# EAGLE design BiaBoard (EAGLE 9.6.2)

## Sheet 1 of 2
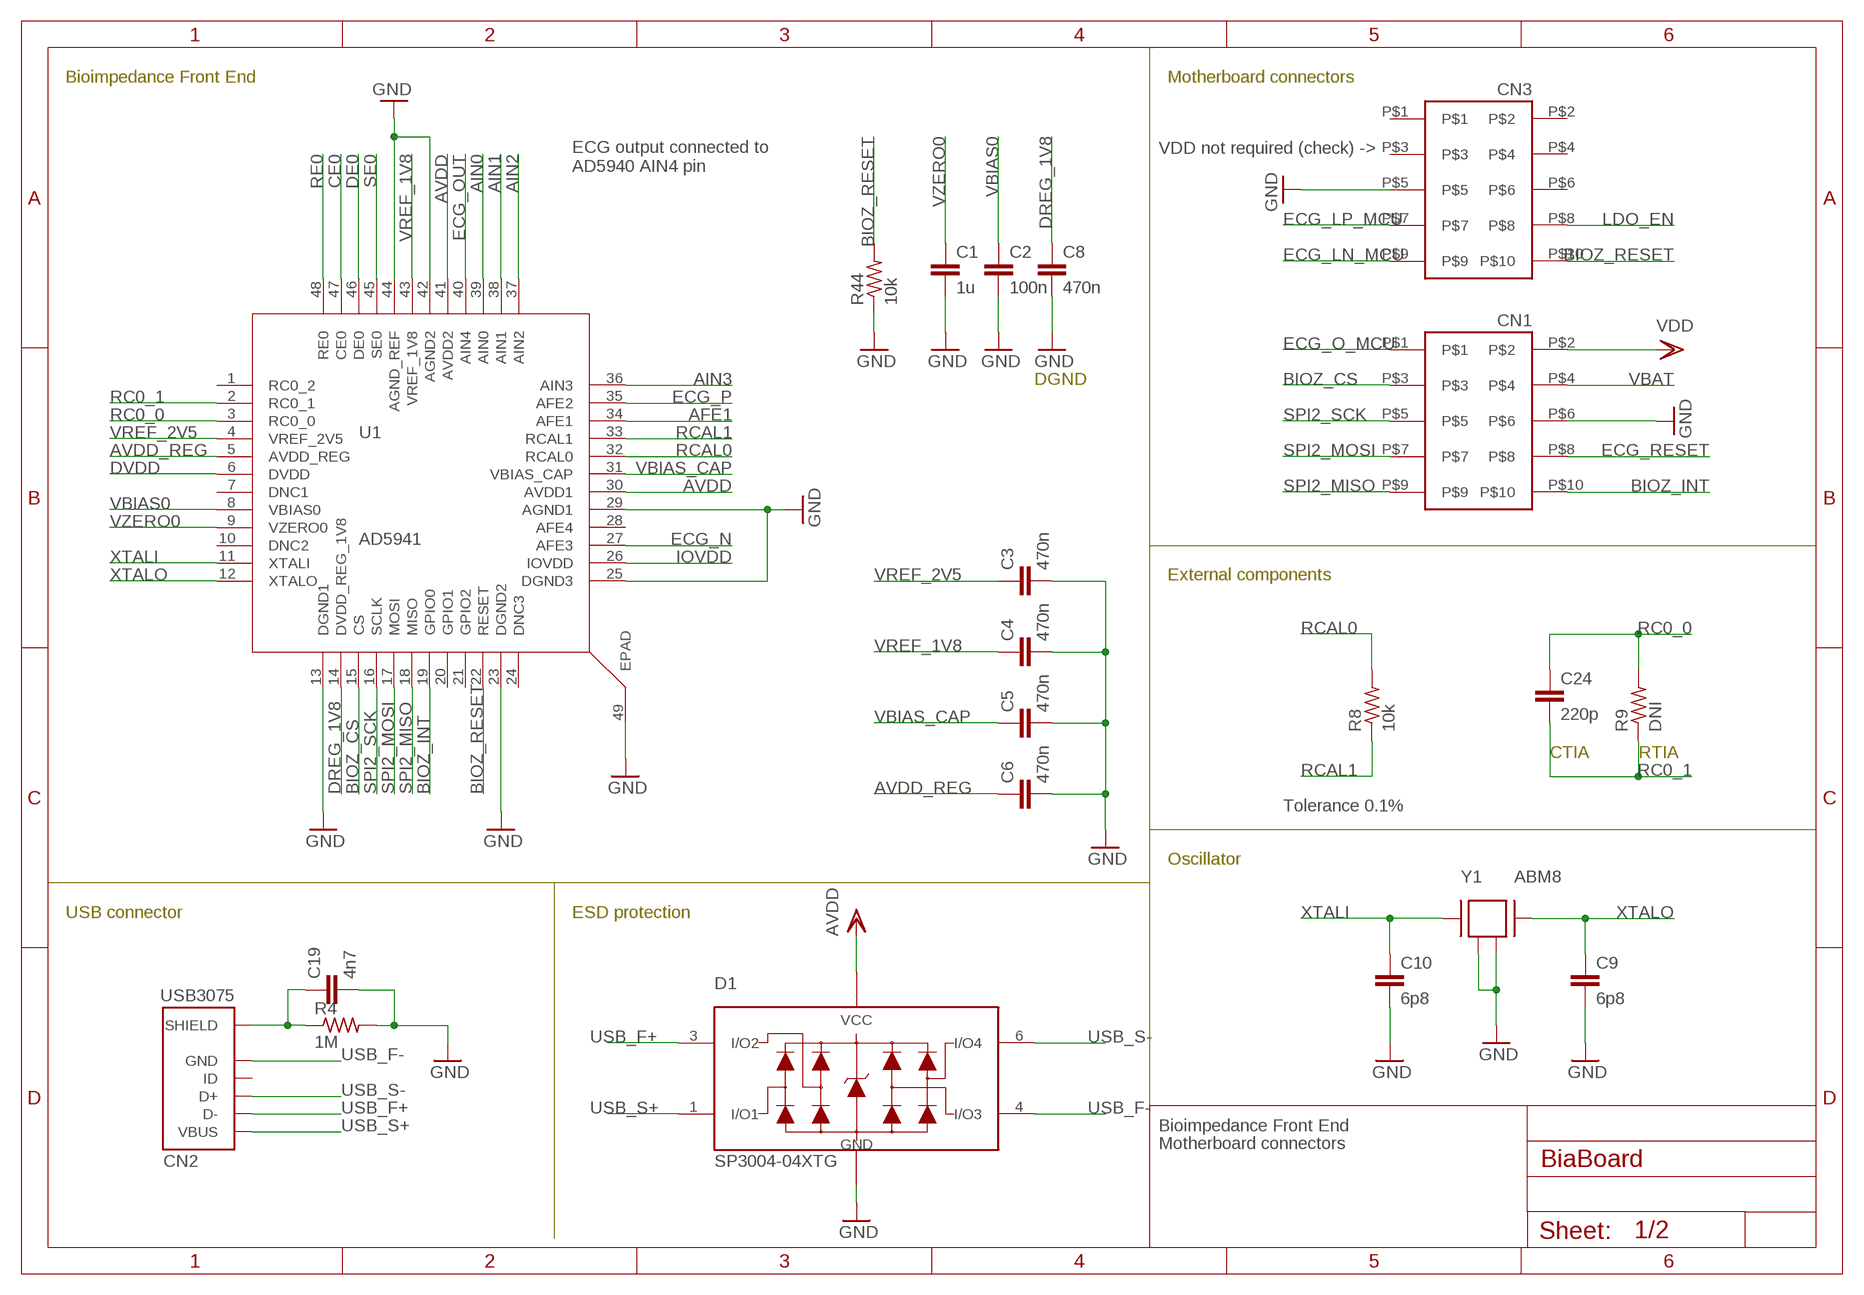
[diagram p0: schematic, sheet 1]

### Parts
C1  1u  C0402  [C0402]
C2  100n  C0402  [C0402]
C3  470n  C0402  [C0402]
C4  470n  C0402  [C0402]
C5  470n  C0402  [C0402]
C6  470n  C0402  [C0402]
C8  470n  C0402  [C0402]
C9  6p8  C0402  [C0402]
C10  6p8  C0402  [C0402]
C19  4n7  C0402  [C0402]
C24  220p  C0402  [C0402]
CN1  FTSH-105TO  [FTSH-105-D]
CN2  USB3075  [USB3075]
CN3  FTSH-105TO  [FTSH-105-D]
D1  SP3004-04XTG  [SOT50P160X60-6N]
R4  1M  R0402  [0402]
R8  10k  R0402  [0402]
R9  DNI  R0402  [0402]
R44  10k  R0402  [0402]
U1  AD5941  [QFN50P700X700X80-49T510N]
Y1  ABM8  [ABM8]

### Nets
AFE1: U1.34(AFE1) ; also sheet 2
AIN0: U1.39(AIN0) ; also sheet 2
AIN1: U1.38(AIN1) ; also sheet 2
AIN2: U1.37(AIN2) ; also sheet 2
AIN3: U1.36(AIN3) ; also sheet 2
AVDD: D1.5(VCC) U1.30(AVDD1) U1.41(AVDD2) ; also sheet 2
AVDD_REG: C6.P$1 U1.5(AVDD_REG)
BIOZ_CS: CN1.P$3 U1.15(CS)
BIOZ_INT: CN1.P$10 U1.19(GPIO0)
BIOZ_RESET: CN3.P$10 R44.P$2 U1.22(RESET)
CE0: U1.47(CE0) ; also sheet 2
DE0: U1.46(DE0) ; also sheet 2
DREG_1V8: C8.P$1 U1.14(DVDD_REG_1V8)
DVDD: U1.6(DVDD) ; also sheet 2
ECG_LN_MCU: CN3.P$9 ; also sheet 2
ECG_LP_MCU: CN3.P$7 ; also sheet 2
ECG_N: U1.27(AFE3) ; also sheet 2
ECG_O_MCU: CN1.P$1 ; also sheet 2
ECG_OUT: U1.40(AIN4) ; also sheet 2
ECG_P: U1.35(AFE2) ; also sheet 2
ECG_RESET: CN1.P$8 ; also sheet 2
GND: C1.P$2 C2.P$2 C3.P$2 C4.P$2 C5.P$2 C6.P$2 C8.P$2 C9.P$2 C10.P$2 C19.P$2 CN1.P$6 CN3.P$5 D1.2(GND) R4.P$2 R44.P$1 U1.13(DGND1) U1.23(DGND2) U1.25(DGND3) U1.29(AGND1) U1.42(AGND2) U1.44(AGND_REF) U1.49(EPAD) Y1.P$2 Y1.P$4 ; also sheet 2
IOVDD: U1.26(IOVDD) ; also sheet 2
LDO_EN: CN3.P$8 ; also sheet 2
N$2: C19.P$1 CN2.G1(SHIELD) CN2.G2(SHIELD) CN2.G3(SHIELD) CN2.G4(SHIELD) CN2.G5(SHIELD) CN2.G6(SHIELD) R4.P$1
RC0_0: C24.P$1 R9.P$2 U1.3(RC0_0)
RC0_1: C24.P$2 R9.P$1 U1.2(RC0_1)
RCAL0: R8.P$2 U1.32(RCAL0)
RCAL1: R8.P$1 U1.33(RCAL1)
RE0: U1.48(RE0) ; also sheet 2
SE0: U1.45(SE0) ; also sheet 2
SPI2_MISO: CN1.P$9 U1.18(MISO)
SPI2_MOSI: CN1.P$7 U1.17(MOSI)
SPI2_SCK: CN1.P$5 U1.16(SCLK)
USB_F+: CN2.P2(D-) D1.3(I/O2) ; also sheet 2
USB_F-: CN2.P5(GND) D1.4(I/O3) ; also sheet 2
USB_S+: CN2.P1(VBUS) D1.1(I/O1) ; also sheet 2
USB_S-: CN2.P3(D+) D1.6(I/O4) ; also sheet 2
VBAT: CN1.P$4 ; also sheet 2
VBIAS0: C2.P$1 U1.8(VBIAS0)
VBIAS_CAP: C5.P$1 U1.31(VBIAS_CAP)
VDD: CN1.P$2 ; also sheet 2
VREF_1V8: C4.P$1 U1.43(VREF_1V8)
VREF_2V5: C3.P$1 U1.4(VREF_2V5)
VZERO0: C1.P$1 U1.9(VZERO0)
XTALI: C10.P$1 U1.11(XTALI) Y1.P$1
XTALO: C9.P$1 U1.12(XTALO) Y1.P$3
Unconnected: CN2.P4(ID) CN3.P$1 CN3.P$2 CN3.P$3 CN3.P$4 CN3.P$6 U1.1(RC0_2) U1.7(DNC1) U1.10(DNC2) U1.20(GPIO1) U1.21(GPIO2) U1.24(DNC3) U1.28(AFE4)

### Notes on the sheet
- Bioimpedance Front End | Motherboard connectors
- VDD not required (check) ->
- ECG output connected to
  AD5940 AIN4 pin
- DGND
- External components
- CTIA | RTIA
- Tolerance 0.1%
- Oscillator
- USB connector | ESD protection
- Bioimpedance Front End
- Motherboard connectors

## Sheet 2 of 2
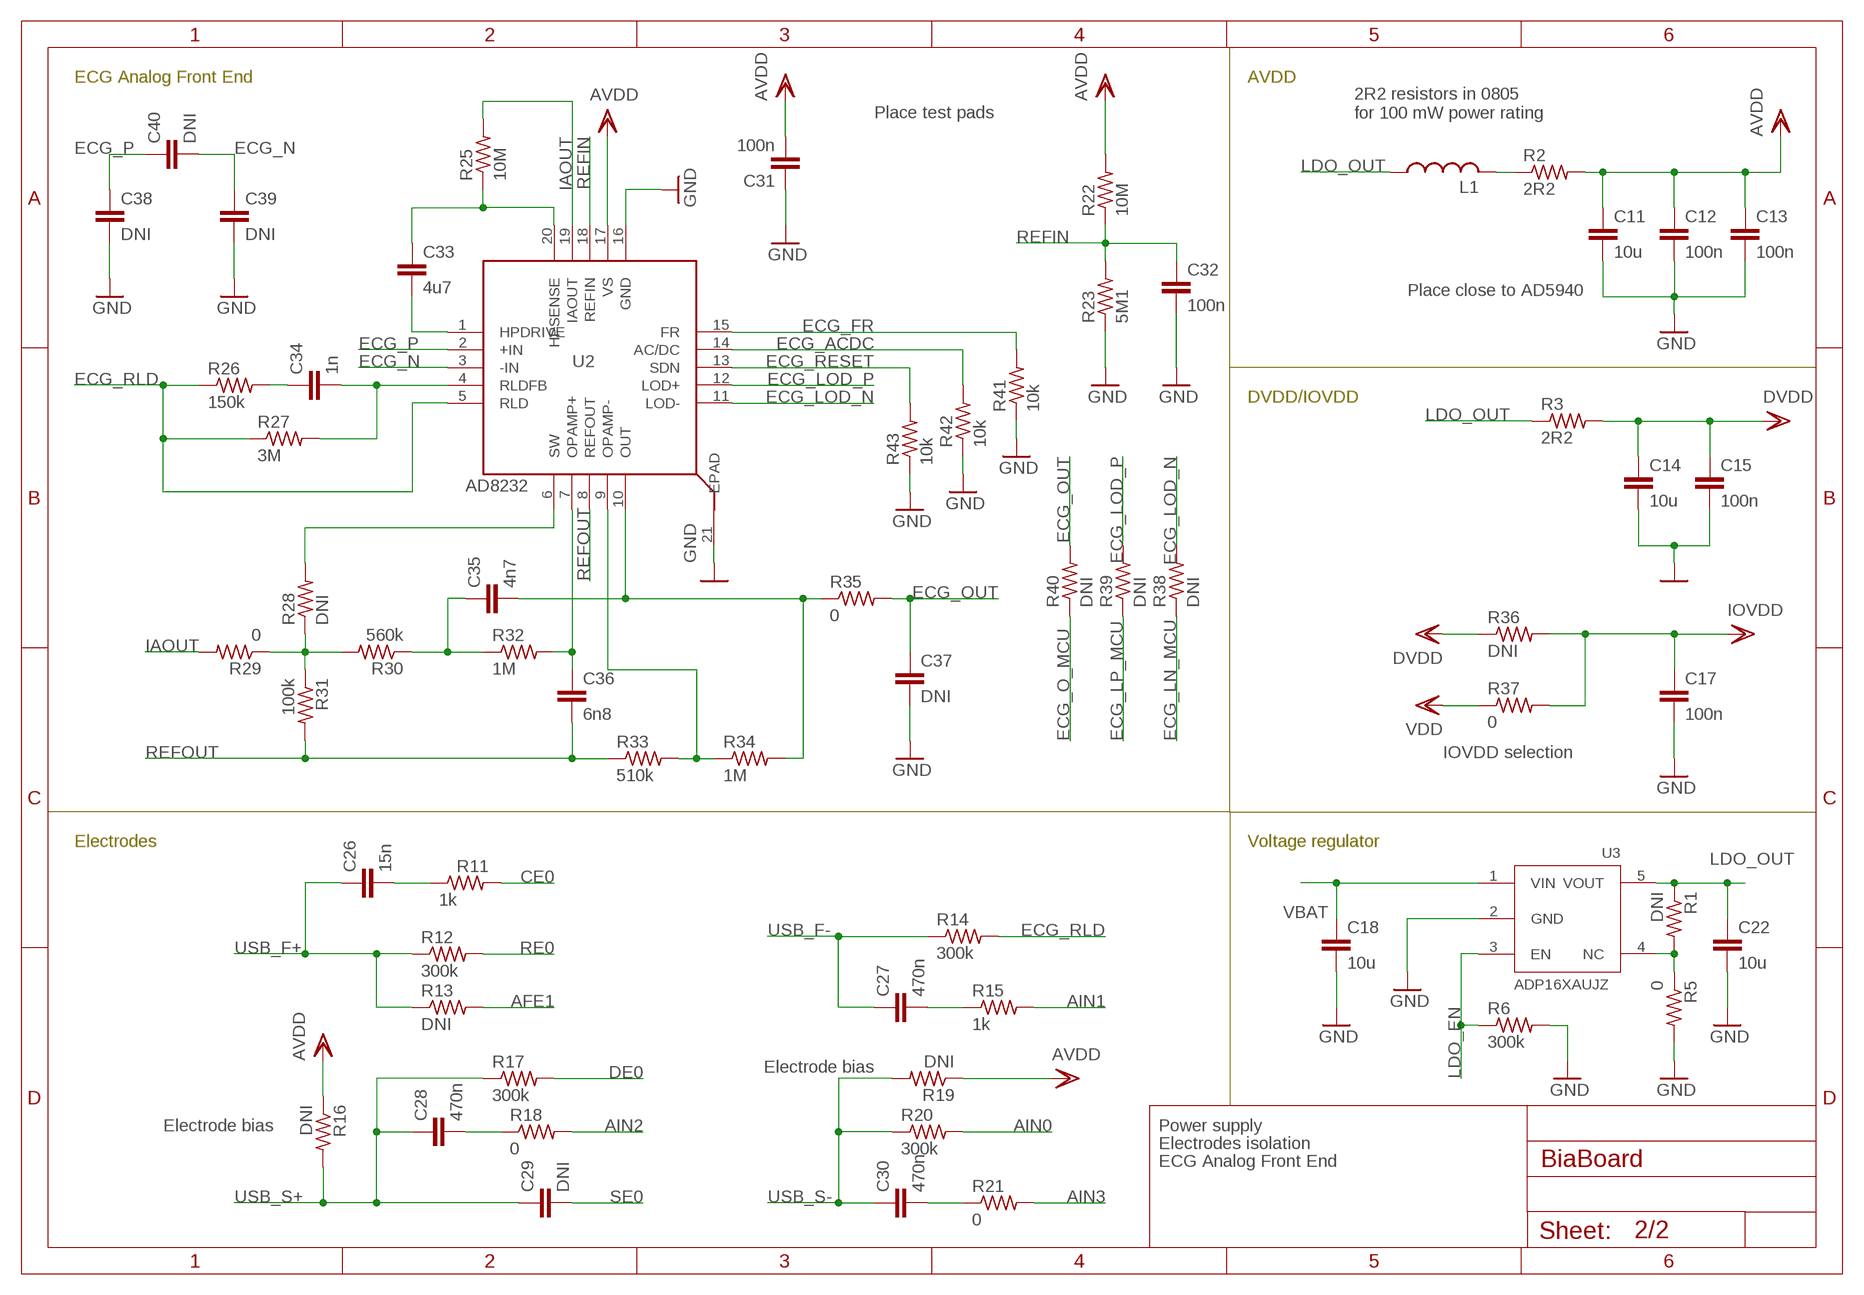
[diagram p1: schematic, sheet 2]

### Parts
C11  10u  C0603  [C0603]
C12  100n  C0402  [C0402]
C13  100n  C0402  [C0402]
C14  10u  C0603  [C0603]
C15  100n  C0402  [C0402]
C17  100n  C0402  [C0402]
C18  10u  C0603  [C0603]
C22  10u  C0603  [C0603]
C26  15n  C0402  [C0402]
C27  470n  C0402  [C0402]
C28  470n  C0402  [C0402]
C29  DNI  C0402  [C0402]
C30  470n  C0402  [C0402]
C31  100n  C0402  [C0402]
C32  100n  C0402  [C0402]
C33  4u7  C0402  [C0402]
C34  1n  C0402  [C0402]
C35  4n7  C0402  [C0402]
C36  6n8  C0402  [C0402]
C37  DNI  C0603  [C0603]
C38  DNI  C0402  [C0402]
C39  DNI  C0402  [C0402]
C40  DNI  C0402  [C0402]
L1  L0603  [0603]
R1  DNI  R0402  [0402]
R2  2R2  R0805  [0805]
R3  2R2  R0805  [0805]
R5  0  R0402  [0402]
R6  300k  R0402  [0402]
R11  1k  R0402  [0402]
R12  300k  R0402  [0402]
R13  DNI  R0402  [0402]
R14  300k  R0402  [0402]
R15  1k  R0402  [0402]
R16  DNI  R0402  [0402]
R17  300k  R0402  [0402]
R18  0  R0402  [0402]
R19  DNI  R0402  [0402]
R20  300k  R0402  [0402]
R21  0  R0402  [0402]
R22  10M  R0402  [0402]
R23  5M1  R0402  [0402]
R25  10M  R0402  [0402]
R26  150k  R0402  [0402]
R27  3M  R0402  [0402]
R28  DNI  R0402  [0402]
R29  0  R0402  [0402]
R30  560k  R0402  [0402]
R31  100k  R0603  [0603]
R32  1M  R0402  [0402]
R33  510k  R0402  [0402]
R34  1M  R0402  [0402]
R35  0  R0402  [0402]
R36  DNI  R0402  [0402]
R37  0  R0402  [0402]
R38  DNI  R0402  [0402]
R39  DNI  R0402  [0402]
R40  DNI  R0402  [0402]
R41  10k  R0402  [0402]
R42  10k  R0402  [0402]
R43  10k  R0402  [0402]
U2  AD8232  [QFN50P400X400X75-21T260N]
U3  ADP16XAUJZ  [TSOT23-5L]

### Nets
AFE1: R13.P$2 ; also sheet 1
AIN0: R20.P$2 ; also sheet 1
AIN1: R15.P$2 ; also sheet 1
AIN2: R18.P$2 ; also sheet 1
AIN3: R21.P$2 ; also sheet 1
AVDD: C11.P$1 C12.P$1 C13.P$1 C31.P$2 R2.P$2 R16.P$1 R19.P$1 R22.P$2 U2.17(VS) ; also sheet 1
CE0: R11.P$2 ; also sheet 1
DE0: R17.P$2 ; also sheet 1
DVDD: C14.P$1 C15.P$1 R3.P$2 R36.P$1 ; also sheet 1
ECG_ACDC: R42.P$2 U2.14(AC/DC)
ECG_FR: R41.P$2 U2.15(FR)
ECG_LN_MCU: R38.P$1 ; also sheet 1
ECG_LOD_N: R38.P$2 U2.11(LOD-)
ECG_LOD_P: R39.P$2 U2.12(LOD+)
ECG_LP_MCU: R39.P$1 ; also sheet 1
ECG_N: C39.P$1 C40.P$2 U2.3(-IN) ; also sheet 1
ECG_O_MCU: R40.P$1 ; also sheet 1
ECG_OUT: C37.P$1 R35.P$2 R40.P$2 ; also sheet 1
ECG_P: C38.P$1 C40.P$1 U2.2(+IN) ; also sheet 1
ECG_RESET: R43.P$2 U2.13(SDN) ; also sheet 1
ECG_RLD: R14.P$2 R26.P$1 R27.P$1 U2.5(RLD)
GND: C11.P$2 C12.P$2 C13.P$2 C14.P$2 C15.P$2 C17.P$2 C18.P$2 C22.P$2 C31.P$1 C32.P$2 C37.P$2 C38.P$2 C39.P$2 R5.P$2 R6.P$2 R23.P$1 R41.P$1 R42.P$1 R43.P$1 U2.16(GND) U2.21(EPAD) U3.2(GND) ; also sheet 1
IAOUT: R25.P$2 R29.P$2 U2.19(IAOUT)
IOVDD: C17.P$1 R36.P$2 R37.P$2 ; also sheet 1
LDO_EN: R6.P$1 U3.3(EN) ; also sheet 1
LDO_OUT: C22.P$1 L1.P$1 R1.P$1 R3.P$1 U3.5(VOUT)
N$1: L1.P$2 R2.P$1
N$3: C26.P$2 R11.P$1
N$4: R1.P$2 R5.P$1 U3.4(NC)
N$7: C27.P$2 R15.P$1
N$8: C30.P$2 R21.P$1
N$9: C28.P$2 R18.P$1
N$14: C33.P$1 R25.P$1 U2.20(HPSENSE)
N$15: C34.P$2 R27.P$2 U2.4(RLDFB)
N$16: C33.P$2 U2.1(HPDRIVE)
N$17: R28.P$1 R29.P$1 R30.P$2 R31.P$1
N$18: C34.P$1 R26.P$2
N$20: R28.P$2 U2.6(SW)
N$21: C35.P$1 R30.P$1 R32.P$1
N$23: C35.P$2 R34.P$2 R35.P$1 U2.10(OUT)
N$24: C36.P$1 R32.P$2 U2.7(OPAMP+)
N$27: R33.P$2 R34.P$1 U2.9(OPAMP-)
RE0: R12.P$2 ; also sheet 1
REFIN: C32.P$1 R22.P$1 R23.P$2 U2.18(REFIN)
REFOUT: C36.P$2 R31.P$2 R33.P$1 U2.8(REFOUT)
SE0: C29.P$2 ; also sheet 1
USB_F+: C26.P$1 R12.P$1 R13.P$1 ; also sheet 1
USB_F-: C27.P$1 R14.P$1 ; also sheet 1
USB_S+: C28.P$1 C29.P$1 R16.P$2 R17.P$1 ; also sheet 1
USB_S-: C30.P$1 R19.P$2 R20.P$1 ; also sheet 1
VBAT: C18.P$1 U3.1(VIN) ; also sheet 1
VDD: R37.P$1 ; also sheet 1

### Notes on the sheet
- ECG Analog Front End | AVDD
- Place test pads
- 2R2 resistors in 0805
  for 100 mW power rating
- Place close to AD5940
- DVDD/IOVDD
- IOVDD selection
- Electrodes | Voltage regulator
- Electrode bias
- Electrode bias | Power supply
- Electrodes isolation
- ECG Analog Front End

## Library data of the parts
C1-C6 C8-C15 C17-C19 C22 C24 C26-C40 = Andrea_passives:C
CN1 CN3 = Andrea_Conn:FTSH-105
CN2 = Andrea_Conn:USB3075: USB3075 Micro USB 2.0 Connector
D1 = Andrea_diodes:SP3004-04XTG: TVS Diode Array Low Capacitance ESD Protection
L1 = Andrea_passives:L; PN: BLM41A800SPB-1806; TOTAL_SURFACE: 36
R1-R6 R9 R11-R23 R25-R44 = Andrea_passives:R
R8 = Andrea_passives:R; TOLERANCE: 0.1%
U1 = Andrea_AD:AD5941: AD5941 High Precision, Impedance, and Electrochemical Front End; PN: AD5941BCPZ; TOTAL_SURFACE: 70
U2 = Andrea_AD:AD8232: AD8232 Single-Lead, Heart Rate Monitor Front End
U3 = Andrea_AD:ADP16X: 5-Lead Thin Small Outline Transistor Package [TSOT] (UJ-5)
Y1 = Andrea_crystals:ABM8: ABM8 Ceramic SMD crystal; PN: ABM8-16.000MHZ-7-1-U-T

## Board
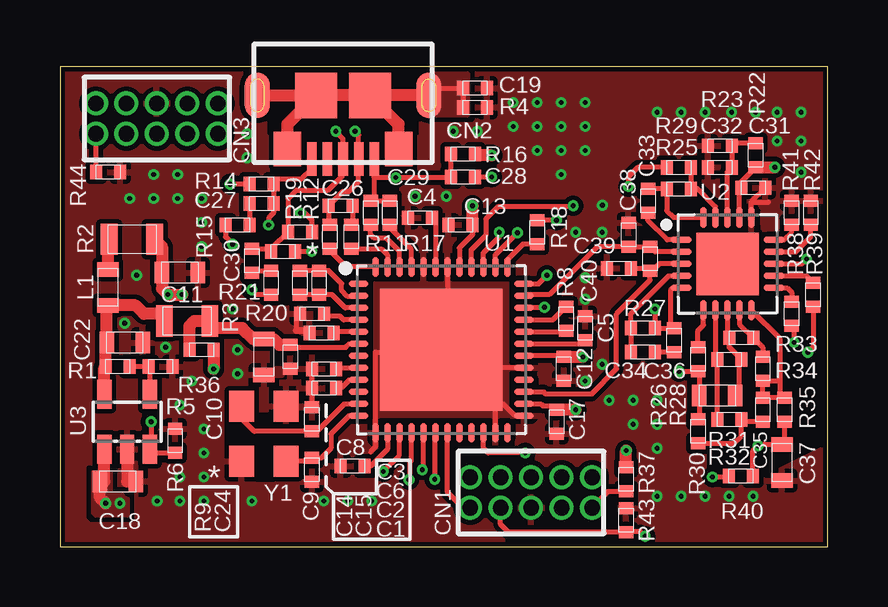
[diagram p2: board, top side]
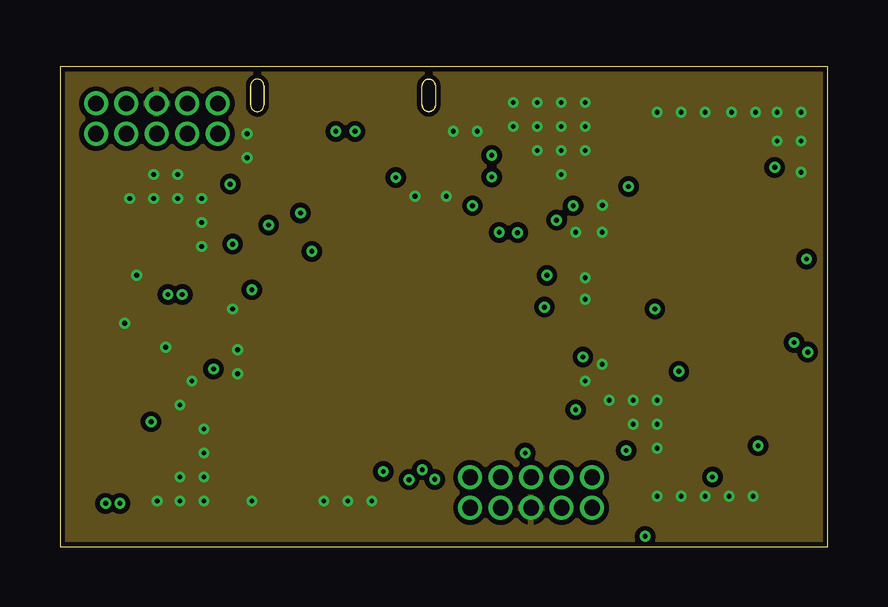
[diagram p3: board, inner layer Route2]
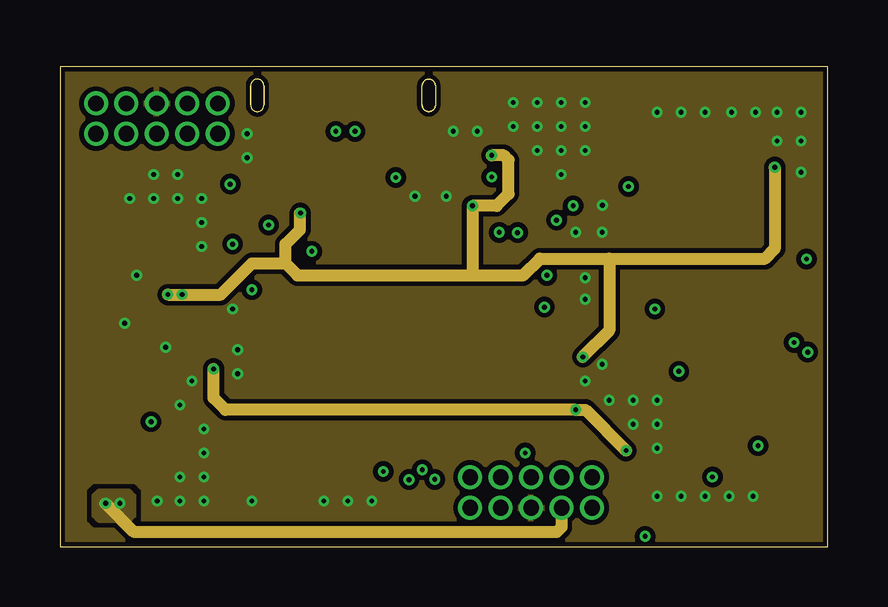
[diagram p4: board, inner layer Route3]
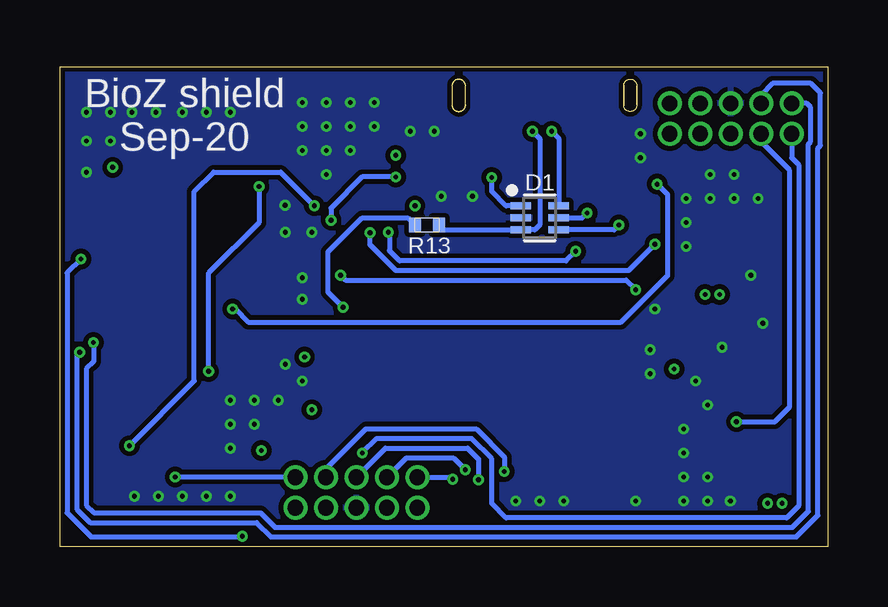
[diagram p5: board, bottom side, seen from below]

Size 32 x 20 mm. Coordinates in mm from the lower left corner, seen from the top.
Outline: 15.1,18.4 15.1,19.2 arc-175 15.65,19.22 15.65,19.2 15.65,18.4 15.65,18.38 arc-175 15.1,18.4
Outline: 7.95,18.4 arc175 8.5,18.38 8.5,18.4 8.5,19.2 8.5,19.22 arc175 7.95,19.2 7.95,18.4
Outline: 0,20 0,0 32,0 32,20 0,20
Copper layers (1+2*3+16): Top 0.018mm / dielectric 0.36mm / Route2 0.035mm / dielectric 0.71mm / Route3 0.035mm / dielectric 0.36mm / Bottom 0.018mm
Design rules "eC_4Layer_PClass6_BaseCopperO18-I35_eCDefault *": minimum track width 0.2mm, minimum drill 0.2mm, track to track 0.2mm, track to pad 0.2mm, pad to pad 0.2mm, via to via 0.2mm, smd to smd 0.2mm, copper to edge 0.2mm, drill to drill 0.2mm, minimum pad ring 0.175mm, minimum via ring 0.125mm, stop-mask expansion 0mil, vias tented up to drill 0.45mm, thermal gap 0.2mm
tRestrict: 31 lines

### Footprints (pad centres in the part's own frame; a part is rotated, then mirrored left to right if it is on the bottom)
C0402 = smd 0.5 x 0.6: P$1 -0.5,0; P$2 0.5,0
C0603 = smd 0.6 x 0.9: P$1 -0.75,0; P$2 0.75,0
FTSH-105-D = drill 0.65 pad 1: P$1 0.5,1.07; P$2 0.5,2.34; P$3 1.77,1.07; P$4 1.77,2.34; P$5 3.04,1.07; P$6 3.04,2.34; P$7 4.31,1.07; P$8 4.31,2.34; P$9 5.58,1.07; P$10 5.58,2.34
USB3075 = smd 1.15 x 1.45: G1 -2.32,2.23; G6 2.32,2.23 | smd 1.05 x 1.9: G2 -3.575,0; G5 3.575,0 | smd 1.75 x 1.9: G3 -1.125,0; G4 1.125,0 | smd 0.4 x 1.4: P1 -1.3,2.65; P2 -0.65,2.65; P3 0,2.65; P4 0.65,2.65; P5 1.3,2.65
SOT50P160X60-6N = smd 0.86 x 0.28: 1 -0.785,0.5; 2 -0.785,0; 3 -0.785,-0.5; 4 0.785,-0.5; 5 0.785,0; 6 0.785,0.5
0603 = smd 0.6 x 0.9: P$1 -0.75,0; P$2 0.75,0
0402 = smd 0.5 x 0.6: P$1 -0.5,0; P$2 0.5,0
0805 = smd 0.7 x 1.3: P$1 -0.95,0; P$2 0.95,0
QFN50P700X700X80-49T510N = smd 0.811 x 0.264: 1 -3.451,2.75; 2 -3.451,2.25; 3 -3.451,1.75; 4 -3.451,1.25; 5 -3.451,0.75; 6 -3.451,0.25; 7 -3.451,-0.25; 8 -3.451,-0.75; 9 -3.451,-1.25; 10 -3.451,-1.75; 11 -3.451,-2.25; 12 -3.451,-2.75; 25 3.451,-2.75; 26 3.451,-2.25; 27 3.451,-1.75; 28 3.451,-1.25; 29 3.451,-0.75; 30 3.451,-0.25; 31 3.451,0.25; 32 3.451,0.75; 33 3.451,1.25; 34 3.451,1.75; 35 3.451,2.25; 36 3.451,2.75 | smd 0.264 x 0.811: 13 -2.75,-3.451; 14 -2.25,-3.451; 15 -1.75,-3.451; 16 -1.25,-3.451; 17 -0.75,-3.451; 18 -0.25,-3.451; 19 0.25,-3.451; 20 0.75,-3.451; 21 1.25,-3.451; 22 1.75,-3.451; 23 2.25,-3.451; 24 2.75,-3.451; 37 2.75,3.451; 38 2.25,3.451; 39 1.75,3.451; 40 1.25,3.451; 41 0.75,3.451; 42 0.25,3.451; 43 -0.25,3.451; 44 -0.75,3.451; 45 -1.25,3.451; 46 -1.75,3.451; 47 -2.25,3.451; 48 -2.75,3.451 | smd 5.1 x 5.1: 49 0,0
QFN50P400X400X75-21T260N = smd 0.86 x 0.264: 1 -1.935,1; 2 -1.935,0.5; 3 -1.935,0; 4 -1.935,-0.5; 5 -1.935,-1; 11 1.935,-1; 12 1.935,-0.5; 13 1.935,0; 14 1.935,0.5; 15 1.935,1 | smd 0.264 x 0.86: 6 -1,-1.935; 7 -0.5,-1.935; 8 0,-1.935; 9 0.5,-1.935; 10 1,-1.935; 16 1,1.935; 17 0.5,1.935; 18 0,1.935; 19 -0.5,1.935; 20 -1,1.935 | smd 2.6 x 2.6: 21 0,0
TSOT23-5L = smd 0.6 x 1.2: 1 -0.95,-1.15; 2 0,-1.15; 3 0.95,-1.15; 4 0.95,1.15; 5 -0.95,1.15
ABM8 = smd 1.3 x 1.05: P$1 -1.15,-0.925; P$2 1.15,-0.925; P$3 1.15,0.925; P$4 -1.15,0.925

### Placement (x,y rotation side)
C1  11,6.6 180 top
C2  11,7.4 180 top
C3  10.5,9.7 180 top
C4  15,13.7 180 top
C5  21.9,9.1 90 top
C6  10.9,8.9 180 top
C8  12.2,3.35 180 top
C9  10.5,3.2 270 top
C10  10.5,5.3 90 top
C11  5,11.42 0 top
C12  21,7.4 270 top
C13  16.7,13.4 180 top
C14  8.5,7.9 270 top
C15  9.6,7.9 270 top
C17  20.7,5.2 270 top
C18  2.41,2.72 0 top
C19  17.3,19.1 0 top
C22  2.7,8.5 0 top
C24  10.8,11 90 top
C26  11.7,14.2 0 top
C27  8.4,14.3 180 top
C28  16.8,15.4 0 top
C29  13.75,13.9 270 top
C30  8,11.9 270 top
C31  28.9,14.95 180 top
C32  27.5,15.8 180 top
C33  24.52,14.41 270 top
C34  24.3,8.1 180 top
C35  29.3,5.7 90 top
C36  27.9,7.8 0 top
C37  30.1,3.5 270 top
C38  23.7,13 90 top
C39  23.3,11.59 180 top
C40  24.6,12 270 top
CN1  22.68,3.96 180 top
CN2  11.8,18.8 180 top
CN3  7.08,19.54 180 top
D1  12,13.7 0 bottom
L1  2,10.8 90 top
R1  2.4,7.5 0 top
R2  3,12.8 0 top
R3  5.3,9.4 0 top
R4  17.3,18.3 0 top
R5  4.2,7.5 0 top
R6  4.8,4.4 90 top
R8  21.1,9.5 270 top
R9  10,11 270 top
R11  12.15,12.9 270 top
R12  11.25,12.9 270 top
R13  16.7,13.4 180 bottom
R14  8.4,15.1 180 top
R15  7.4,13.4 180 top
R16  16.8,16.35 180 top
R17  12.95,13.9 270 top
R18  19.9,13.1 270 top
R19  10,13.1 180 top
R20  9.3,12.3 0 top
R21  8.8,11 270 top
R22  29,16.3 270 top
R23  27.5,16.7 0 top
R25  25.8,14.9 0 top
R26  25.6,8.6 270 top
R27  24.3,9.1 180 top
R28  26.6,7.8 90 top
R29  25.8,15.8 0 top
R30  26.6,4.8 90 top
R31  27.4,6.3 0 top
R32  27.9,5.3 180 top
R33  28.4,8.7 0 top
R34  29.3,7.4 270 top
R35  30.2,5.7 270 top
R36  5.9,8.2 0 top
R37  23.6,2.8 90 top
R38  30.5,9.7 90 top
R39  31.4,10.5 90 top
R40  28.39,2.94 0 top
R41  30.5,13.9 270 top
R42  31.3,13.9 270 top
R43  23.6,1.1 270 top
R44  2,15.6 180 top
U1  15.9,8.2 0 top
U2  27.83,11.78 0 top
U3  2.8,5.2 0 top
Y1  8.5,4.7 270 top

### Tracks (layer width: path | path; a pad name or v marks a point on that pad's centre or on a via)
AFE1  (via drill 0.2)
  Top 0.2: U1.34 19.38,9.97 v20.2,9.97
  Bottom 0.2: R13.P$2 17.5,13.7 19.4,13.7 20.82,12.28 20.82,10.6 v20.2,9.97
AIN0  (via drill 0.2)
  Top 0.2: U1.39 17.65,12.23 18.31,12.89 v18.31,13.09 | R20.P$2 v10.5,12.3
  Bottom 0.2: v10.5,12.3 10.9,11.9 17.83,11.9 18.27,12.33 18.27,13.05 v18.31,13.09
AIN1  (via drill 0.2)
  Top 0.2: U1.38 18.15,12.15 v19.08,13.08 | R15.P$2 6.9,12.9 v7.2,12.6
  Bottom 0.2: v7.2,12.6 8.3,11.5 18,11.5 19.08,12.58 v19.08,13.08
AIN2
  Top 0.2: 18.65,11.68 U1.37 18.65,11.95 19.3,12.6 R18.P$2
AIN3  (via drill 0.2)
  Top 0.2: v20.3,11.3 19.95,10.95 U1.36 | R21.P$2 8.2,10.5 v8,10.7
  Bottom 0.2: v20.3,11.3 20.1,11.1 8.4,11.1 v8,10.7
AVDD  (via drill 0.2)
  Top 0.2: C12.P$1 20.95,7.95 U1.30 | U2.17 28.33,14.88 C31.P$2 28.4,15.2 R22.P$2 | 17.35,16.3 R16.P$1 | R19.P$1 10.5,13.6 10.2,13.9 v10.03,13.9 | 17.2,13.2 C13.P$1 17.2,13 16.65,12.45 U1.41
  Top 0.5: R22.P$2 v29.8,15.8 | C12.P$1 v21.8,7.9 | v18,16.3 17.35,16.3 | C13.P$1 v17.2,14.2 | v5.1,10.5 v4.5,10.5 4.25,10.75 C11.P$1 4.25,12.5 R2.P$2
  Route3 0.2: 10,13.88 v10.03,13.9
  Route3 0.5: 9.4,11.8 9.9,11.3 17.2,11.3 | 17.2,11.3 19.3,11.3 20,12 22.9,12 | 22.9,12 29.4,12 29.8,12.4 v29.8,15.8 | 9.4,11.8 9.4,12.6 10,13.2 10,13.88 | 22.9,12 22.9,9 v21.8,7.9 | 17.2,11.3 v17.2,14.2 18.2,14.2 18.7,14.7 18.7,16.1 18.5,16.3 v18,16.3 | v4.5,10.5 6.7,10.5 8,11.8 9.4,11.8
  Bottom 0.2: D1.5 10.22,13.7 v10.03,13.9
AVDD_REG
  Top 0.2: U1.5 11.45,8.95 C6.P$1
BIOZ_CS  (via drill 0.2)
  Top 0.2: v13.47,3.13 14.15,3.81 U1.15
  Bottom 0.2: CN1.P$3 20.91,3.24 19.25,4.9 14.64,4.9 13.47,3.73 v13.47,3.13
BIOZ_INT
  Top 0.2: CN1.P$10 16.8,1.62 16.15,2.27 U1.19
BIOZ_RESET  (via drill 0.2)
  Top 0.2: v19.4,3.9 17.85,3.9 17.65,4.1 U1.22 | R44.P$2 CN3.P$10
  Bottom 0.2: CN3.P$10 1.5,16.2 1.2,15.9 1.2,1.7 1.7,1.2 13.4,1.2 14,1.8 14,3.66 14.84,4.5 18.8,4.5 v19.4,3.9
CE0
  Top 0.2: R11.P$2 13.4,12.4 13.65,12.15 U1.47
DE0
  Top 0.2: U1.46 14.15,12.32 13.62,12.85 13.1,12.85 12.95,13 R17.P$2
DREG_1V8
  Top 0.2: C8.P$1 12.95,3.35 13.65,4.05 U1.14
DVDD
  Top 0.2: C15.P$1 9.7,8.3 11.91,8.3 12.05,8.43 12.43,8.43 U1.6 | R3.P$2 6.55,9.1
  Top 0.5: R36.P$1 5.4,9.2 5.6,9.4 R3.P$2 | 6.55,9.1 7.6,9.1 8.05,8.65 C14.P$1 8.9,8.65 9.15,8.4 C15.P$1
ECG_ACDC
  Top 0.2: 29.79,12.3 U2.14 30.68,12.28 31.3,12.9 R42.P$2
ECG_FR
  Top 0.2: 29.79,12.8 U2.15 30.18,12.78 30.5,13.1 R41.P$2
ECG_LN_MCU  (via drill 0.2)
  Top 0.2: R38.P$1 30.6,9.1 v30.6,8.5
  Bottom 0.2: v30.6,8.5 30.6,7.7 30.9,7.4 30.9,1.73 30.57,1.4 23.63,1.4 23.03,0.8 1.47,0.8 0.8,1.47 0.8,16.77 0.7,16.87 0.7,18.3 0.87,18.47 CN3.P$9
ECG_LOD_N
  Top 0.2: U2.11 30.32,10.78 30.5,10.6 R38.P$2
ECG_LOD_P
  Top 0.2: U2.12 31.12,11.28 R39.P$2
ECG_LP_MCU  (via drill 0.2)
  Top 0.2: R39.P$1 31.4,8.32 v31.18,8.1
  Bottom 0.2: v31.18,8.1 31.3,7.97 31.3,1.57 30.73,1 23.8,1 23.2,0.4 1.3,0.4 0.4,1.3 0.4,16.6 0.3,16.7 0.3,18.9 0.7,19.3 2.3,19.3 2.77,18.83 CN3.P$7
ECG_N
  Top 0.2: U2.3 24.98,11.78 24.7,11.5 C40.P$2 | U1.27 20.15,6.45 20.25,6.35 22.15,6.35 23.2,7.4 23.2,9.7 24.6,11.1 C40.P$2 | C39.P$1 24.51,11.59 C40.P$2
ECG_O_MCU  (via drill 0.2)
  Top 0.2: R40.P$1 27.85,2.9 v27.2,2.9
  Bottom 0.2: v27.2,2.9 CN1.P$1
ECG_OUT  (via drill 0.2)
  Top 0.2: R35.P$2 30.2,4.35 C37.P$1 | C37.P$1 30.06,4.29 | U1.40 17.15,12.38 17.75,12.98 17.75,13.65 18.25,14.15 21.4,14.15 v21.4,14.2 | C37.P$1 29.15,4.25 v29.1,4.2 28.89,3.99 R40.P$2
  Bottom 0.2: v29.1,4.2 26.4,6.9 26.4,14.8 25.6,15.6 22.8,15.6 v21.4,14.2
ECG_P
  Top 0.2: 25.86,12.3 25.86,12.31 U2.2 24.82,12.28 C40.P$1 C38.P$1 22.4,12.5 20.4,10.5 19.4,10.5 U1.35
ECG_RESET  (via drill 0.2)
  Top 0.2: U2.13 30.92,11.78 v31.12,11.98 | CN1.P$8 18.37,0.93 18.7,0.6 R43.P$2 23.62,0.62 24.2,0.62 v24.4,0.42
  Bottom 0.2: v24.4,0.42 24.43,0.4 30.7,0.4 31.7,1.4 31.7,11.4 v31.12,11.98
ECG_RLD  (via drill 0.2)
  Top 0.2: U2.5 25.55,10.78 25.45,10.69 25.45,9.25 R26.P$1 R27.P$1 v24.8,9.9 | R14.P$2 v7.1,15.1
  Bottom 0.2: v24.8,9.9 24.7,9.9 24.15,9.35 8.61,9.35 6.67,11.28 6.67,14.68 v7.1,15.1
GND  (via drill 0.2)
  Top 0.2: U2.21 28.08,11.78 28.83,12.53 | C10.P$2 C1.P$2 C2.P$2 | U1.29 16.65,7.45 | 16.65,7.45 16,8.1 | 16,8.1 U1.49 | U1.42 16.15,8.25 16,8.1 | U1.23 18.15,5.95 | 18.15,5.95 16.65,7.45 | U1.25 19.33,5.47 18.95,5.47 18.47,5.95 18.15,5.95 | 16,8.1 13.15,8.1 13.15,5.02 U1.13 13.15,4.15 12.95,3.95 | C6.P$2 10.3,9 10.2,9 | C3.P$2 9.85,9.55 9.85,9 | C31.P$1 28.83,14.38 U2.16 28.83,14.35 29.55,14.35
  Top 0.3: 10.2,9 9.85,9
  Top 0.5: U3.2 2.8,2.72 C18.P$2
  other vias: 13,1.9 12,1.9 11,1.9 8,1.9 6,1.9 5,1.9 6,2.9 6,3.9 6,4.9 5,5.9 7.4,7.2 7.4,8.2 7.2,9.9 5.9,12.5 5.9,13.5 5.9,14.5 4.9,15.5 3.9,15.5 7.8,16.2 18.9,17.5 18.9,18.5 19.9,18.5 19.9,17.5 19.9,16.5 20.9,16.5 20.9,17.5 20.9,18.5 20.9,15.5 21.9,16.5 21.9,17.5 21.9,18.5 25.9,18.1 26.9,18.1 28,18.1 29,18.1 24.9,18.1 29.9,18.1 30.9,15.6 30.9,18.1 30.9,16.9 29.9,16.9 21.9,10.3 21.9,6.9 22.6,7.6 21.9,11.2 21.5,13.1 22.6,13.1 22.62,14.22 14.8,14.6 16.1,14.6 17.4,17.3 16.4,17.3 7.8,17.2 24.9,2.1 25.9,2.1 26.9,2.1 27.9,2.1 28.9,2.1 24.9,4.1 24.9,5.1 24.9,6.1 23.9,6.1 22.9,6.1 23.9,5.1 5.5,6.9 5,2.9 4.05,1.9 2.7,9.3 3.2,11.3 3.9,14.5 4.9,14.5 2.9,14.5 4.4,8.3
  pour Route2 (rank 4): 0,0 0,20 32,20 32,0
  pour Top (rank 4): 0,0 32,0 32,20 0,20
  pour Route3 (rank 4): 0,0 32,0 32,20 0,20
  pour Bottom: 0,0 32,0 32,20 0,20
IAOUT
  Top 0.2: U2.19 27.33,14.17 26.6,14.9 R25.P$2 R29.P$2
IOVDD  (via drill 0.2)
  Top 0.2: U1.26 20.05,5.95 20.15,5.85 20.55,5.85 C17.P$1
  Top 0.5: R37.P$2 v23.6,4 | v21.5,5.7 C17.P$1 | R36.P$2 v6.4,7.4
  Route3 0.5: v6.4,7.4 6.4,6.2 6.9,5.7 v21.5,5.7 21.9,5.7 v23.6,4
LDO_EN  (via drill 0.2)
  Top 0.2: v3.8,5.2 3.8,4.1 U3.3 3.9,3.9 R6.P$1
  Bottom 0.2: CN3.P$8 2.77,16.87 1.6,15.7 1.6,5.8 2.2,5.2 v3.8,5.2
LDO_OUT
  Top 0.2: R1.P$1 1.95,7.55 | C22.P$1 1.95,8.6
  Top 0.5: U3.5 1.85,7.45 R1.P$1 1.9,8.55 1.95,8.6 | L1.P$1 2,10 | R3.P$1 4.35,9.7 3.5,9.7 3.15,10.05 L1.P$1 | C22.P$1 1.95,10 L1.P$1
N$1
  Top 0.5: L1.P$2 2,12.75 R2.P$1
N$2
  Top 0.2: R4.P$1 C19.P$1 15.68,19.1 CN2.G2
  Top 0.5: CN2.G1 14.12,17.61 CN2.G3 | CN2.G6 9.48,17.61 CN2.G4 | CN2.G2 CN2.G3 | CN2.G3 CN2.G4 | CN2.G5 CN2.G4
  pour Top (no thermals): 15.2,18 17,18 17,19.7 15.2,19.7
N$3
  Top 0.2: C26.P$2 12.2,13.45 R11.P$1
N$4
  Top 0.2: U3.4 3.75,7.45 R5.P$1 R1.P$2
N$7
  Top 0.2: C27.P$2 R15.P$1
N$8
  Top 0.2: C30.P$2 8.1,11.5 R21.P$1
N$9  (via drill 0.2)
  Top 0.2: C28.P$2 v18,15.4 | v20.7,13.6 R18.P$1
  Bottom 0.2: v18,15.4 19.4,15.4 20.7,14.1 v20.7,13.6
N$14
  Top 0.2: 26.83,13.97 U2.20 25.59,13.71 25.3,14 R25.P$1 C33.P$1
N$15
  Top 0.2: C34.P$2 R27.P$2 23.8,9.7 25.38,11.28 U2.4
N$16
  Top 0.2: U2.1 25.32,12.78 24.52,13.58 C33.P$2
N$17  (via drill 0.2)
  Top 0.2: R30.P$2 26.65,5.35 R31.P$1 26.65,7.25 R28.P$1 v25.8,7.3 | R29.P$1 24.1,15.8 23.7,15.4 v23.7,15
  Bottom 0.2: v25.8,7.3 25.8,11.4 23.7,13.5 v23.7,15
N$18
  Top 0.2: R26.P$2 C34.P$1
N$20
  Top 0.2: R28.P$2 26.6,9 26.83,9.23 U2.6
N$21
  Top 0.2: R30.P$1 28.1,4.3 28.4,4.6 R32.P$1 28.5,5.2 C35.P$1
N$23
  Top 0.2: U2.10 30,8.68 30,6.9 | 30,6.9 30,6.4 R35.P$1 C35.P$2 R34.P$2 30,6.9
N$24
  Top 0.2: U2.7 27.33,7.87 C36.P$1 R32.P$2
N$27
  Top 0.2: U2.9 28.33,9.27 R33.P$2 29.3,8.3 R34.P$1
RC0_0
  Top 0.2: U1.3 11.89,9.95 11.34,10.5 C24.P$1 R9.P$2
RC0_1
  Top 0.2: U1.2 12.42,10.42 12,10.42 11.74,10.67 11.74,10.96 11.2,11.5 C24.P$2 R9.P$1
RCAL0
  Top 0.2: U1.32 21.05,8.95 R8.P$2
RCAL1
  Top 0.2: U1.33 20.55,9.45 R8.P$1
RE0
  Top 0.2: U1.48 11.93,11.65 11.25,12.33 R12.P$2
REFIN
  Top 0.2: U2.18 27.83,15.63 C32.P$1 R23.P$2 28.1,16.8 R22.P$1
REFOUT
  Top 0.2: U2.8 27.83,8.77 R33.P$1 27.9,8.3 C36.P$2 28.3,7.7 28.3,6.45 R31.P$2
SE0
  Top 0.2: U1.45 14.65,12.38 13.75,13.28 C29.P$2
SPI2_MISO  (via drill 0.2)
  Top 0.2: v15.62,2.8 15.62,4.72 U1.18
  Bottom 0.2: CN1.P$9 15.71,2.89 v15.62,2.8
SPI2_MOSI  (via drill 0.2)
  Top 0.2: v15.1,3.2 15.15,3.25 U1.17
  Bottom 0.2: CN1.P$7 17.56,3.7 15.6,3.7 v15.1,3.2
SPI2_SCK  (via drill 0.2)
  Top 0.2: v14.55,2.79 14.57,2.81 14.57,3.52 14.65,3.59 U1.16
  Bottom 0.2: CN1.P$5 18.43,4.1 15.01,4.1 14.55,3.64 v14.55,2.79
USB_F+  (via drill 0.2)
  Top 0.2: R12.P$1 11.2,13.45 C26.P$1 11.8,14.8 12.05,14.8 12.45,15.2 CN2.P2 12.45,17.15 v12.3,17.3
  Bottom 0.2: v12.3,17.3 12,17 12,13.4 12.2,13.2 D1.3 16,13.2 R13.P$1
USB_F-  (via drill 0.2)
  Top 0.2: CN2.P5 10.5,15.75 10.05,15.3 9.1,15.3 R14.P$1 C27.P$1 8.9,13.9 8.7,13.7 v8.7,13.4
  Bottom 0.2: v8.7,13.4 8.9,13.2 D1.4
USB_S+  (via drill 0.2)
  Top 0.2: R16.P$2 C28.P$1 16.27,15.38 v14,15.38 13.1,15.38 CN2.P1 13.1,14.4 | R17.P$1 13.1,14.4 | 13.1,14.4 C29.P$1
  Bottom 0.2: D1.1 13.4,14.2 14,14.8 v14,15.38
USB_S-  (via drill 0.2)
  Top 0.2: v11.5,17.3 11.8,17 CN2.P3 11.8,15.48 11.17,14.85 9.85,14.85 9.5,14.5 R19.P$2 8.8,12.4 R20.P$1 8.7,12.4 C30.P$1
  Bottom 0.2: v11.5,17.3 11.2,17 11.2,14.21 D1.6
VBAT  (via drill 0.2)
  Top 0.5: v1.9,1.8 1.66,2.04 C18.P$1 | C18.P$1 1.8,2.86 | C18.P$1 1.85,2.72 U3.1
  Route3 0.5: CN1.P$4 20.91,0.81 20.7,0.6 3.1,0.6 v1.9,1.8
  other vias: 2.5,1.8
  pour Route3 (no thermals): 2.4,1.1 2.9,1.1 3.1,1.3 3.1,2.1 2.9,2.3 1.6,2.3 1.5,2.2 1.4,2.1 1.4,1.4 1.4,1.3 1.6,1.1
  pour Top (no thermals): 1.4,3.1 2.1,3.1 2.1,2.2 2.6,2.2 2.8,2 2.8,1.3 1.5,1.3 1.4,1.4
VBIAS0
  Top 0.2: C2.P$1 11.55,7.45 U1.8
VBIAS_CAP
  Top 0.2: C5.P$1 21.75,8.45 U1.31
VDD
  Top 0.2: CN1.P$2 22.86,2.3 R37.P$1
VREF_1V8
  Top 0.2: C4.P$1 15.65,13.55 U1.43
VREF_2V5
  Top 0.2: U1.4 11.82,9.45 11.67,9.6 11.1,9.6 C3.P$1
VZERO0
  Top 0.2: U1.9 12.43,6.93 12.05,6.93 11.71,6.6 C1.P$1
XTALI
  Top 0.2: Y1.P$1 7.58,5.33 8.1,4.8 C10.P$1 10.71,4.8 11.87,5.95 U1.11
XTALO
  Top 0.2: U1.12 12.05,5.45 11.3,4.7 11.3,4.1 10.9,3.7 C9.P$1 10.5,3.55 Y1.P$3

### Text on the board
tPlace: * | *
bNames: BioZ shield / Sep-20